# EasyEDA Pro project CH32X033SimpleBoard_PCB.epro

# Board PCB1_PCB
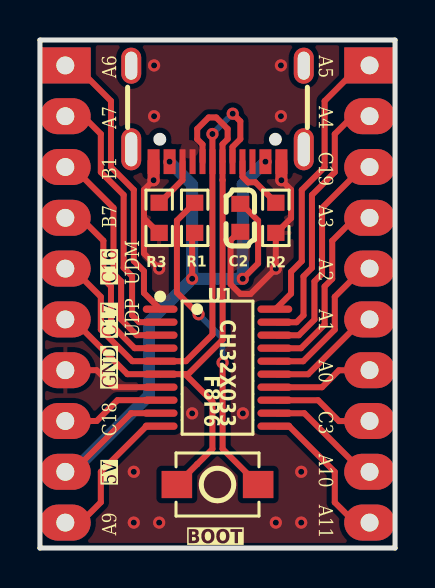
[diagram p0: board, top side]
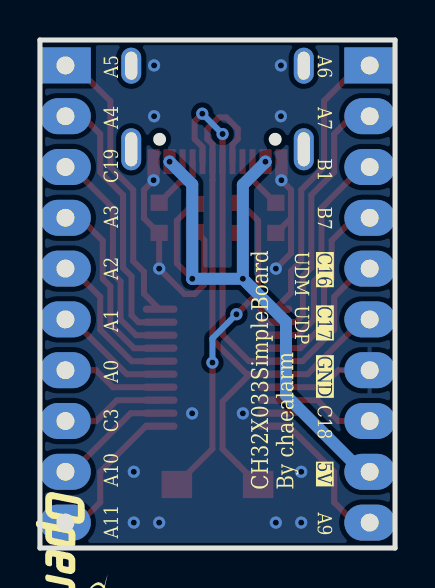
[diagram p1: board, bottom side, seen from below]

Outline 17.78 x 25.4 mm; copper layers: Top Layer, Bottom Layer. Coordinates in mm from the lower left corner of the outline.
Outline path: 0,25.4 17.78,25.4 17.78,0 0,0 0,25.4
Stack: Top Layer 0.035mm / Dielectric1 1.51mm FR4 er 4.5 / Bottom Layer 0.035mm

## Design rules (mm)
template: JLCPCB Capability(Two Layers Board)
spacing copperThickness1oz (default): track to track 0.102, other pairs 0.152 to 0.3
spacing copperThickness2oz: track to track 0.203, other pairs 0.152 to 0.3
track width copperThickness1oz (default): min 0.127, default 0.254, max 2.54
track width copperThickness2oz: min 0.203, default 0.254, max 2.54
differential pair differentialPair (default): width min 0.127, default 0.254, max 2.54; gap min 0.152, default 0.152
via viaSize (default): diameter min 0.5, default 0.61, max 10; hole min 0.3, default 0.305, max 6.3

## Placement (name value [footprint] x y rotation side)
BOOT  YTS1T0092CBG00  [SW-SMD_L4.0-W2.9-LS5.0]  8.89 3.17 0 top
C2  10uF  [C0603]  10.03 16.51 90 top
H1  2.54X10 MALE HEADER  [footprint_8cc6]  1.27 8.89 270 top
H2  2.54X10 MALE HEADER  [footprint_8cc6]  16.5 8.89 270 top
R1  5.1kΩ  [R0603]  7.75 16.51 90 top
R2  5.1kΩ  [R0603]  11.81 16.51 90 top
R3  5.1kΩ  [R0603]  5.97 16.51 90 top
U1  CH32X033F8P6  [TSSOP-20_L6.5-W4.4-P0.65-LS6.4-BL]  8.89 9.02 270 top
USB1  GT-USB-7010ASV  [USB-C-SMD_G-SWITCH_GT-USB-7010ASV]  8.89 21.72 180 top

## Footprints (pads in the part's own frame, mm; a bottom-side part is the same pattern mirrored in y, then rotated)
C0603
  rect 0.8x0.9 smd: 1(-0.7,0) 2(0.7,0)
footprint_8cc6
  rect 1.8x2.54 hole 0.889x0.894: 1(-15.24,0)
  oval 1.8x2.54 hole 0.889x0.894: 2(-12.7,0) 3(-10.16,0) 4(-7.62,0) 5(-5.08,0) 6(-2.54,0) 7(0,0) 8(2.54,0) 9(5.08,0) 10(7.62,0)
R0603
  rect 0.806x0.864 smd: 1(-0.753,0) 2(0.753,0)
SW-SMD_L4.0-W2.9-LS5.0
  rect 1.53x1.36 smd: 1(-2.035,0) 2(2.035,0)
TSSOP-20_L6.5-W4.4-P0.65-LS6.4-BL
  oval 0.364x1.742 smd: 1(-2.925,-2.871) 2(-2.275,-2.871) 3(-1.625,-2.871) 4(-0.975,-2.871) 5(-0.325,-2.871) 6(0.325,-2.871) 7(0.975,-2.871) 8(1.625,-2.871) 9(2.275,-2.871) 10(2.925,-2.871) 11(2.925,2.871) 12(2.275,2.871) 13(1.625,2.871) 14(0.975,2.871) 15(0.325,2.871) 16(-0.325,2.871) 17(-0.975,2.871) 18(-1.625,2.871) 19(-2.275,2.871) 20(-2.925,2.871)
USB-C-SMD_G-SWITCH_GT-USB-7010ASV
  oval 1x2.1 hole 0.6x1.7: 1(-4.32,1.78) 2(4.32,1.78)
  oval 1x1.8 hole 0.6x1.4: 3(4.32,-2.4) 4(-4.32,-2.4)
  rect 0.6x1.24 smd: A1B12(-3.2,2.4) A4B9(-2.4,2.4) B1A12(3.2,2.4) B4A9(2.4,2.4)
  rect 0.3x1.24 smd: A5(-1.25,2.4) A6(-0.25,2.4) A7(0.25,2.4) A8(1.25,2.4) B5(1.75,2.4) B6(0.75,2.4) B7(-0.75,2.4) B8(-1.75,2.4)

## Nets
+5V: C2.2 H1.9 R1.1 U1.9 USB1.A4B9 USB1.B4A9
GND: C2.1 H1.7 R2.1 R3.1 U1.7 USB1.A1B12 USB1.B1A12
PA0: H2.7 U1.14
PA1: H2.6 U1.15
PA2: H2.5 U1.16
PA3: H2.4 U1.17
PA4: H2.2 U1.19
PA5: H2.1 U1.20
PA6: H1.1 U1.1
PA7: H1.2 U1.2
PA9: H1.10 U1.10
PA10: H2.9 U1.12
PA11: H2.10 U1.11
PB1: H1.3 U1.3
PB7: H1.4 U1.4
PC3: H2.8 U1.13
PC18: H1.8 U1.8
PC19: H2.3 U1.18
UDM: H1.5 U1.5 USB1.A7 USB1.B7
UDP: BOOT.1 H1.6 U1.6 USB1.A6 USB1.B6
$1N1999: R2.2 USB1.A5
$1N2038: R3.2 USB1.B5
$1N5785: BOOT.2 R1.2

Pads without a net: USB1 1 2 3 4 A8 B8

## Via types
v1: diameter 0.61, hole 0.305, Top Layer to Bottom Layer, 24 vias

## Routing (per net, layer and track width the routed paths; a pad name or vN(x,y) marks a point on that pad's centre or on a via; arc(x,y) is an arc through that point)
+5V: length 40.5
  Top Layer w0.3: U1.9 4.57,6.74 1.64,3.81 H1.9 ; R1.1 7.72,15.76 7.62,15.66 v1(7.62,13.46) ; v1(10.15,13.46) 10.92,14.23 10.92,16.37 10.08,17.21 C2.2
  Bottom Layer w0.6: v1(7.62,13.46) v1(10.15,13.46) 10.15,18.18 v1(11.29,19.32) ; v1(7.62,13.46) 5.46,11.3 5.46,7.63 1.64,3.81 H1.9 ; v1(7.62,13.46) 7.62,18.16 6.49,19.29 v1(6.49,19.32)
GND: length 23.8
  Top Layer w0.3: v1(5.69,18.39) 5.21,17.91 5.21,16.49 ; H1.7 2.84,8.89 3.69,8.04 U1.7 ; C2.1 9.97,15.81 9.55,15.39 9.55,13.19 10.03,12.7 10.54,12.7 v1(11.81,13.97) R2.1 11.84,15.76 12.57,16.49 12.57,17.91 v1(12.09,18.39) ; 5.21,16.49 5.94,15.76 R3.1 ; 5.21,16.49 5.21,14.73 v1(5.97,13.97)
  Top Layer w0.6: USB1.B1A12 v1(5.69,18.39) ; USB1.A1B12 v1(12.09,18.39)
  vias: v1(4.7,3.81) v1(4.7,1.27) v1(5.72,24.13) v1(5.72,21.59) v1(5.97,1.27) v1(7.62,6.73) v1(10.16,6.73) v1(11.81,1.27) v1(12.06,24.13) v1(12.06,21.59) v1(13.08,3.81) v1(13.08,1.27)
PA0: length 5.1
  Top Layer w0.3: 16.54,8.89 14.97,8.89 14.12,8.04 11.79,8.04
PA1: length 5.9
  Top Layer w0.3: 11.79,8.69 13.43,8.69 16.17,11.43 16.54,11.43
PA2: length 7.6
  Top Layer w0.3: 16.54,13.97 16.17,13.97 14.76,12.56 14.76,10.92 13.18,9.34 11.79,9.34
PA3: length 9.7
  Top Layer w0.3: 16.54,16.51 15.78,16.51 14.63,15.36 14.63,13.46 14.25,13.08 14.25,11.17 13.07,9.99 11.79,9.99
PA4: length 13.4
  Top Layer w0.3: 11.79,11.29 12.84,11.29 13.19,11.64 13.19,13.59 13.62,14.01 13.62,17.65 14.76,18.79 14.76,20.7 15.65,21.59 16.54,21.59
PA5: length 14.5
  Top Layer w0.3: 11.79,11.94 12.57,12.72 12.57,13.81 13.11,14.35 13.11,17.9 14.25,19.05 14.25,22.35 16.03,24.13 16.54,24.13
PA6: length 14.5
  Top Layer w0.3: U1.1 5.21,12.75 5.21,13.84 4.7,14.35 4.7,17.91 3.56,19.05 3.56,22.35 1.78,24.13 1.27,24.13
PA7: length 13.4
  Top Layer w0.3: 6.02,11.29 4.96,11.29 4.61,11.64 4.61,13.59 4.19,14.01 4.19,17.65 3.05,18.8 3.05,20.7 2.16,21.59 H1.2
PA9: length 7.6
  Top Layer w0.3: 1.27,1.27 2.03,1.27 3.05,2.29 3.05,3.81 5.33,6.09 6.02,6.09
PA10: length 6
  Top Layer w0.3: 16.54,3.81 16.17,3.81 13.24,6.74 11.79,6.74
PA11: length 7.6
  Top Layer w0.3: 11.79,6.09 12.48,6.09 14.76,3.81 14.76,2.28 15.78,1.27 16.54,1.27
PB1: length 11.3
  Top Layer w0.3: U1.3 4.85,10.64 4.06,11.43 4.06,13.34 3.68,13.72 3.68,17.01 1.64,19.05 H1.3
PB7: length 9.7
  Top Layer w0.3: U1.4 4.74,9.99 3.56,11.18 3.56,13.08 3.18,13.46 3.18,15.37 2.03,16.51 H1.4
PC3: length 5.2
  Top Layer w0.3: 16.54,6.35 14.97,6.35 13.93,7.39 11.79,7.39
PC18: length 5.2
  Top Layer w0.3: U1.8 3.88,7.39 2.84,6.35 1.27,6.35
PC19: length 11.3
  Top Layer w0.3: 11.79,10.64 12.96,10.64 13.75,11.42 13.75,13.33 14.13,13.71 14.13,17 16.17,19.05 16.54,19.05
UDM: length 25
  Top Layer w0.3: USB1.B7 9.64,20.05 10.03,20.45 10.03,21.34 v1(9.65,21.72) ; v1(8.64,20.7) 8.64,10.67 7.31,9.34 U1.5 4.63,9.34 3.05,10.92 3.05,12.56 1.64,13.97 H1.5
  Bottom Layer w0.3: v1(8.64,20.7) v1(9.65,21.72)
UDP: length 30.9
  Top Layer w0.3: 7.27,8.69 U1.6 4.38,8.69 1.64,11.43 H1.6 ; 7.27,8.69 8.64,7.32 8.64,4.95 7.87,4.19 7.87,4.19 BOOT.1 ; 7.27,8.69 7.42,8.69 9.14,10.41 9.14,18.39 9.14,18.4 USB1.A6 9.14,20.19 9.4,20.45 9.4,20.95 8.83,21.53 8.45,21.53 7.87,20.95 7.87,20.45 8.14,20.18 USB1.B6
$1N1999: length 3
  Top Layer w0.3: R2.2 10.79,18.29 10.41,18.29 10.14,18.56 USB1.A5
$1N2038: length 2.6
  Top Layer w0.3: R3.2 6,17.26 7.14,18.41 USB1.B5
$1N5785: length 16.1
  Top Layer w0.3: BOOT.2 9.14,4.96 v1(9.14,9.27) ; R1.2 6.86,16.37 6.86,12.77 v1(7.94,11.69)
  Bottom Layer w0.3: v1(9.14,9.27) 9.14,10.49 v1(7.94,11.69)

## Copper pours and planes (outline as drawn; the poured copper is in the pictures)
GND on Top Layer: -0.63,26.04 18.29,26.04 18.29,-0.63 -0.63,-0.63
GND on Bottom Layer: -1.27,26.8 18.8,26.8 18.8,-1.27 -1.27,-1.27

## Text on the board
Bottom Silkscreen Layer: A9 | A5 | A4 | C19 | A3 | A2 | A1 | A0 | C3 | A10 | A11 | A6 | A7 | B1 | B7 | C16 | C17 | GND | C18 | 5V | UDM | UDP | By chaealarm | CH32X033SimpleBoard
Top Silkscreen Layer: F8P6 | CH32X033 | A6 | A7 | B1 | B7 | C16 | C17 | GND | C18 | 5V | UDM | UDP | A5 | A4 | C19 | A3 | A2 | A1 | A0 | C3 | A10 | A11 | A9
